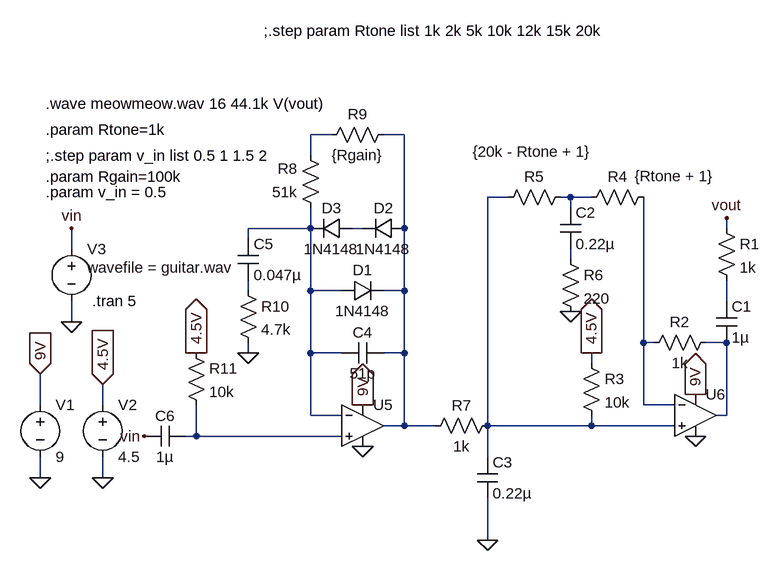
[diagram p0: schematic tube_screamer_sch.asc]
tube_screamer_sch.asc, the LTspice schematic file:
Version 4
SHEET 1 880 680
WIRE -320 -128 -352 -128
WIRE -208 -128 -240 -128
WIRE -352 -96 -352 -128
WIRE -48 -32 -80 -32
WIRE 48 -32 32 -32
WIRE 80 -32 48 -32
WIRE 48 -16 48 -32
WIRE -352 16 -352 -16
WIRE -352 16 -448 16
WIRE -272 16 -288 16
WIRE -208 16 -208 -128
WIRE 288 16 288 0
WIRE -448 32 -448 16
WIRE -720 48 -720 16
WIRE 48 64 48 48
WIRE -448 112 -448 96
WIRE -352 112 -352 16
WIRE -304 112 -352 112
WIRE -208 112 -208 16
WIRE -208 112 -240 112
WIRE 288 128 288 96
WIRE -720 160 -720 128
WIRE 160 192 160 -32
WIRE 176 192 160 192
WIRE 288 192 256 192
WIRE -448 208 -448 192
WIRE -352 208 -352 112
WIRE -304 208 -352 208
WIRE -208 208 -208 112
WIRE -208 208 -240 208
WIRE 80 224 80 208
WIRE -768 288 -768 240
WIRE -672 288 -672 256
WIRE 160 288 160 192
WIRE 208 288 160 288
WIRE -352 304 -352 208
WIRE -304 304 -352 304
WIRE 288 304 288 192
WIRE 288 304 272 304
WIRE -208 320 -208 208
WIRE -208 320 -240 320
WIRE -160 320 -208 320
WIRE -80 320 -80 -32
WIRE 80 320 80 304
WIRE 80 320 -80 320
WIRE 208 320 80 320
WIRE -528 336 -528 288
WIRE -528 336 -544 336
WIRE -304 336 -528 336
WIRE -80 368 -80 320
WIRE -768 400 -768 368
WIRE -672 400 -672 368
WIRE -80 496 -80 432
FLAG 48 144 0
FLAG -448 208 0
FLAG -272 352 0
FLAG -80 496 0
FLAG 240 336 0
FLAG -768 400 0
FLAG -672 400 0
FLAG -768 240 9V
IOPIN -768 240 In
FLAG -272 288 9V
IOPIN -272 288 Out
FLAG 240 272 9V
IOPIN 240 272 Out
FLAG -672 256 4.5V
IOPIN -672 256 In
FLAG -528 208 4.5V
IOPIN -528 208 Out
FLAG 80 208 4.5V
IOPIN 80 208 Out
FLAG 288 0 vout
FLAG -720 160 0
FLAG -720 16 vin
FLAG -608 336 vin
SYMBOL res 272 0 R0
SYMATTR InstName R1
SYMATTR Value 1k
SYMBOL cap 272 128 R0
SYMATTR InstName C1
SYMATTR Value 1µ
SYMBOL res 272 176 R90
WINDOW 0 0 56 VBottom 2
WINDOW 3 32 56 VTop 2
SYMATTR InstName R2
SYMATTR Value 1k
SYMBOL res 64 208 R0
SYMATTR InstName R3
SYMATTR Value 10k
SYMBOL res 176 -48 R90
WINDOW 0 0 56 VBottom 2
WINDOW 3 -32 -32 VTop 2
SYMATTR InstName R4
SYMATTR Value {Rtone + 1}
SYMBOL res 48 -48 R90
WINDOW 0 0 56 VBottom 2
WINDOW 3 -70 59 VTop 2
SYMATTR InstName R5
SYMATTR Value {20k - Rtone + 1}
SYMBOL cap 32 -16 R0
SYMATTR InstName C2
SYMATTR Value 0.22µ
SYMBOL res 32 48 R0
SYMATTR InstName R6
SYMATTR Value 220
SYMBOL res -64 304 R90
WINDOW 0 0 56 VBottom 2
WINDOW 3 32 56 VTop 2
SYMATTR InstName R7
SYMATTR Value 1k
SYMBOL cap -96 368 R0
SYMATTR InstName C3
SYMATTR Value 0.22µ
SYMBOL cap -240 192 R90
WINDOW 0 0 32 VBottom 2
WINDOW 3 32 32 VTop 2
SYMATTR InstName C4
SYMATTR Value 51p
SYMBOL diode -304 128 R270
WINDOW 0 32 32 VTop 2
WINDOW 3 0 32 VBottom 2
SYMATTR InstName D1
SYMATTR Value 1N4148
SYMBOL diode -208 0 R90
WINDOW 0 0 32 VBottom 2
WINDOW 3 32 32 VTop 2
SYMATTR InstName D2
SYMATTR Value 1N4148
SYMBOL res -336 0 R180
WINDOW 0 36 76 Left 2
WINDOW 3 36 40 Left 2
SYMATTR InstName R8
SYMATTR Value 51k
SYMBOL res -224 -144 R90
WINDOW 0 0 56 VBottom 2
WINDOW 3 32 56 VTop 2
SYMATTR InstName R9
SYMATTR Value {Rgain}
SYMBOL cap -464 32 R0
SYMATTR InstName C5
SYMATTR Value 0.047µ
SYMBOL res -464 96 R0
SYMATTR InstName R10
SYMATTR Value 4.7k
SYMBOL res -544 192 R0
SYMATTR InstName R11
SYMATTR Value 10k
SYMBOL voltage -768 272 R0
WINDOW 123 0 0 Left 0
WINDOW 39 0 0 Left 0
SYMATTR InstName V1
SYMATTR Value 9
SYMBOL voltage -672 272 R0
WINDOW 123 0 0 Left 0
WINDOW 39 0 0 Left 0
SYMATTR InstName V2
SYMATTR Value 4.5
SYMBOL voltage -720 32 R0
WINDOW 3 24 44 Left 2
SYMATTR Value wavefile = guitar.wav
SYMATTR InstName V3
SYMBOL cap -544 320 R90
WINDOW 0 0 32 VBottom 2
WINDOW 3 32 32 VTop 2
SYMATTR InstName C6
SYMATTR Value 1µ
SYMBOL OpAmps\\UniversalOpAmp -272 320 R0
SYMATTR InstName U5
SYMBOL OpAmps\\UniversalOpAmp 240 304 R0
SYMATTR InstName U6
SYMBOL diode -288 0 R90
WINDOW 0 0 32 VBottom 2
WINDOW 3 32 32 VTop 2
SYMATTR InstName D3
SYMATTR Value 1N4148
TEXT -760 -64 Left 2 !.param Rgain=100k
TEXT -760 -136 Left 2 !.param Rtone=1k
TEXT -688 128 Left 2 !.tran 5
TEXT -424 -288 Left 2 !;.step param Rtone list 1k 2k 5k 10k 12k 15k 20k
TEXT -760 -40 Left 2 !.param v_in = 0.5
TEXT -760 -96 Left 2 !;.step param v_in list 0.5 1 1.5 2
TEXT -760 -176 Left 2 !.wave meowmeow.wav 16 44.1k V(vout)

The netlist it stands for:
* tube_screamer_sch.asc
R1 vout N009 1k
C1 N009 N011 1µ
R2 N011 N010 1k
R3 4.5V N003 10k
R4 N010 N004 {Rtone + 1}
R5 N004 N003 {20k - Rtone + 1}
C2 N004 N007 0.22µ
R6 N007 0 220
R7 N003 N002 1k
C3 N003 0 0.22µ
C4 N002 N005 51p
D1 N005 N002 1N4148
D2 N002 N006 1N4148
R8 N005 N001 51k
R9 N002 N001 {Rgain}
C5 N005 N008 0.047µ
R10 N008 0 4.7k
R11 4.5V N012 10k
V1 9V 0 9
V2 4.5V 0 4.5
V3 vin 0 wavefile = guitar.wav
C6 N012 vin 1µ
XU5 N012 N005 9V 0 N002 level1 Avol=1Meg GBW=10Meg Vos=0 En=0 Enk=0 In=0 Ink=0 Rin=500Meg  ; pins In+ In- V+ V- OUT
XU6 N003 N010 9V 0 N011 level1 Avol=1Meg GBW=10Meg Vos=0 En=0 Enk=0 In=0 Ink=0 Rin=500Meg  ; pins In+ In- V+ V- OUT
D3 N006 N005 1N4148
.model D D
.lib standard.dio
.param Rgain=100k
.param Rtone=1k
.tran 5
;.step param Rtone list 1k 2k 5k 10k 12k 15k 20k
.param v_in = 0.5
;.step param v_in list 0.5 1 1.5 2
.wave meowmeow.wav 16 44.1k V(vout)
.lib UniversalOpAmp1.lib
.backanno
.end